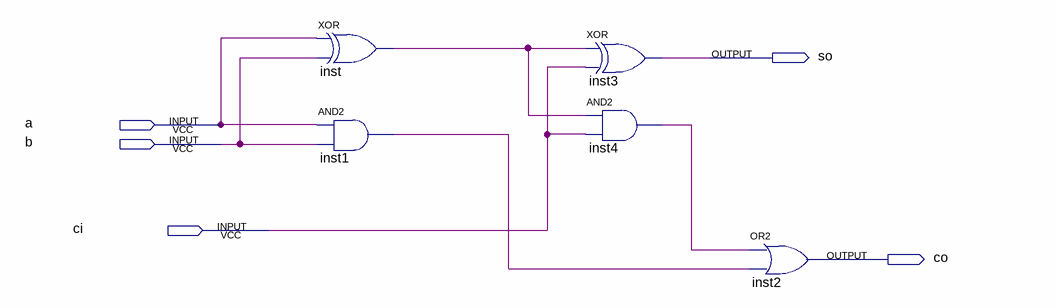
[diagram p0: schematic sheet]
// Quartus schematic my_faddr.bdf as structural Verilog: 5 symbols, 5 pins
module my_faddr (
  input  a,
  input  b,
  input  ci,
  output so,
  output co
);

  wire inst1_out, inst4_out, inst_out;

  xor inst (inst_out, a, b);
  and inst1 (inst1_out, a, b);
  xor inst3 (so, inst_out, ci);
  and inst4 (inst4_out, inst_out, ci);
  or inst2 (co, inst4_out, inst1_out);
endmodule
